# Altium project RMS.PrjPcb
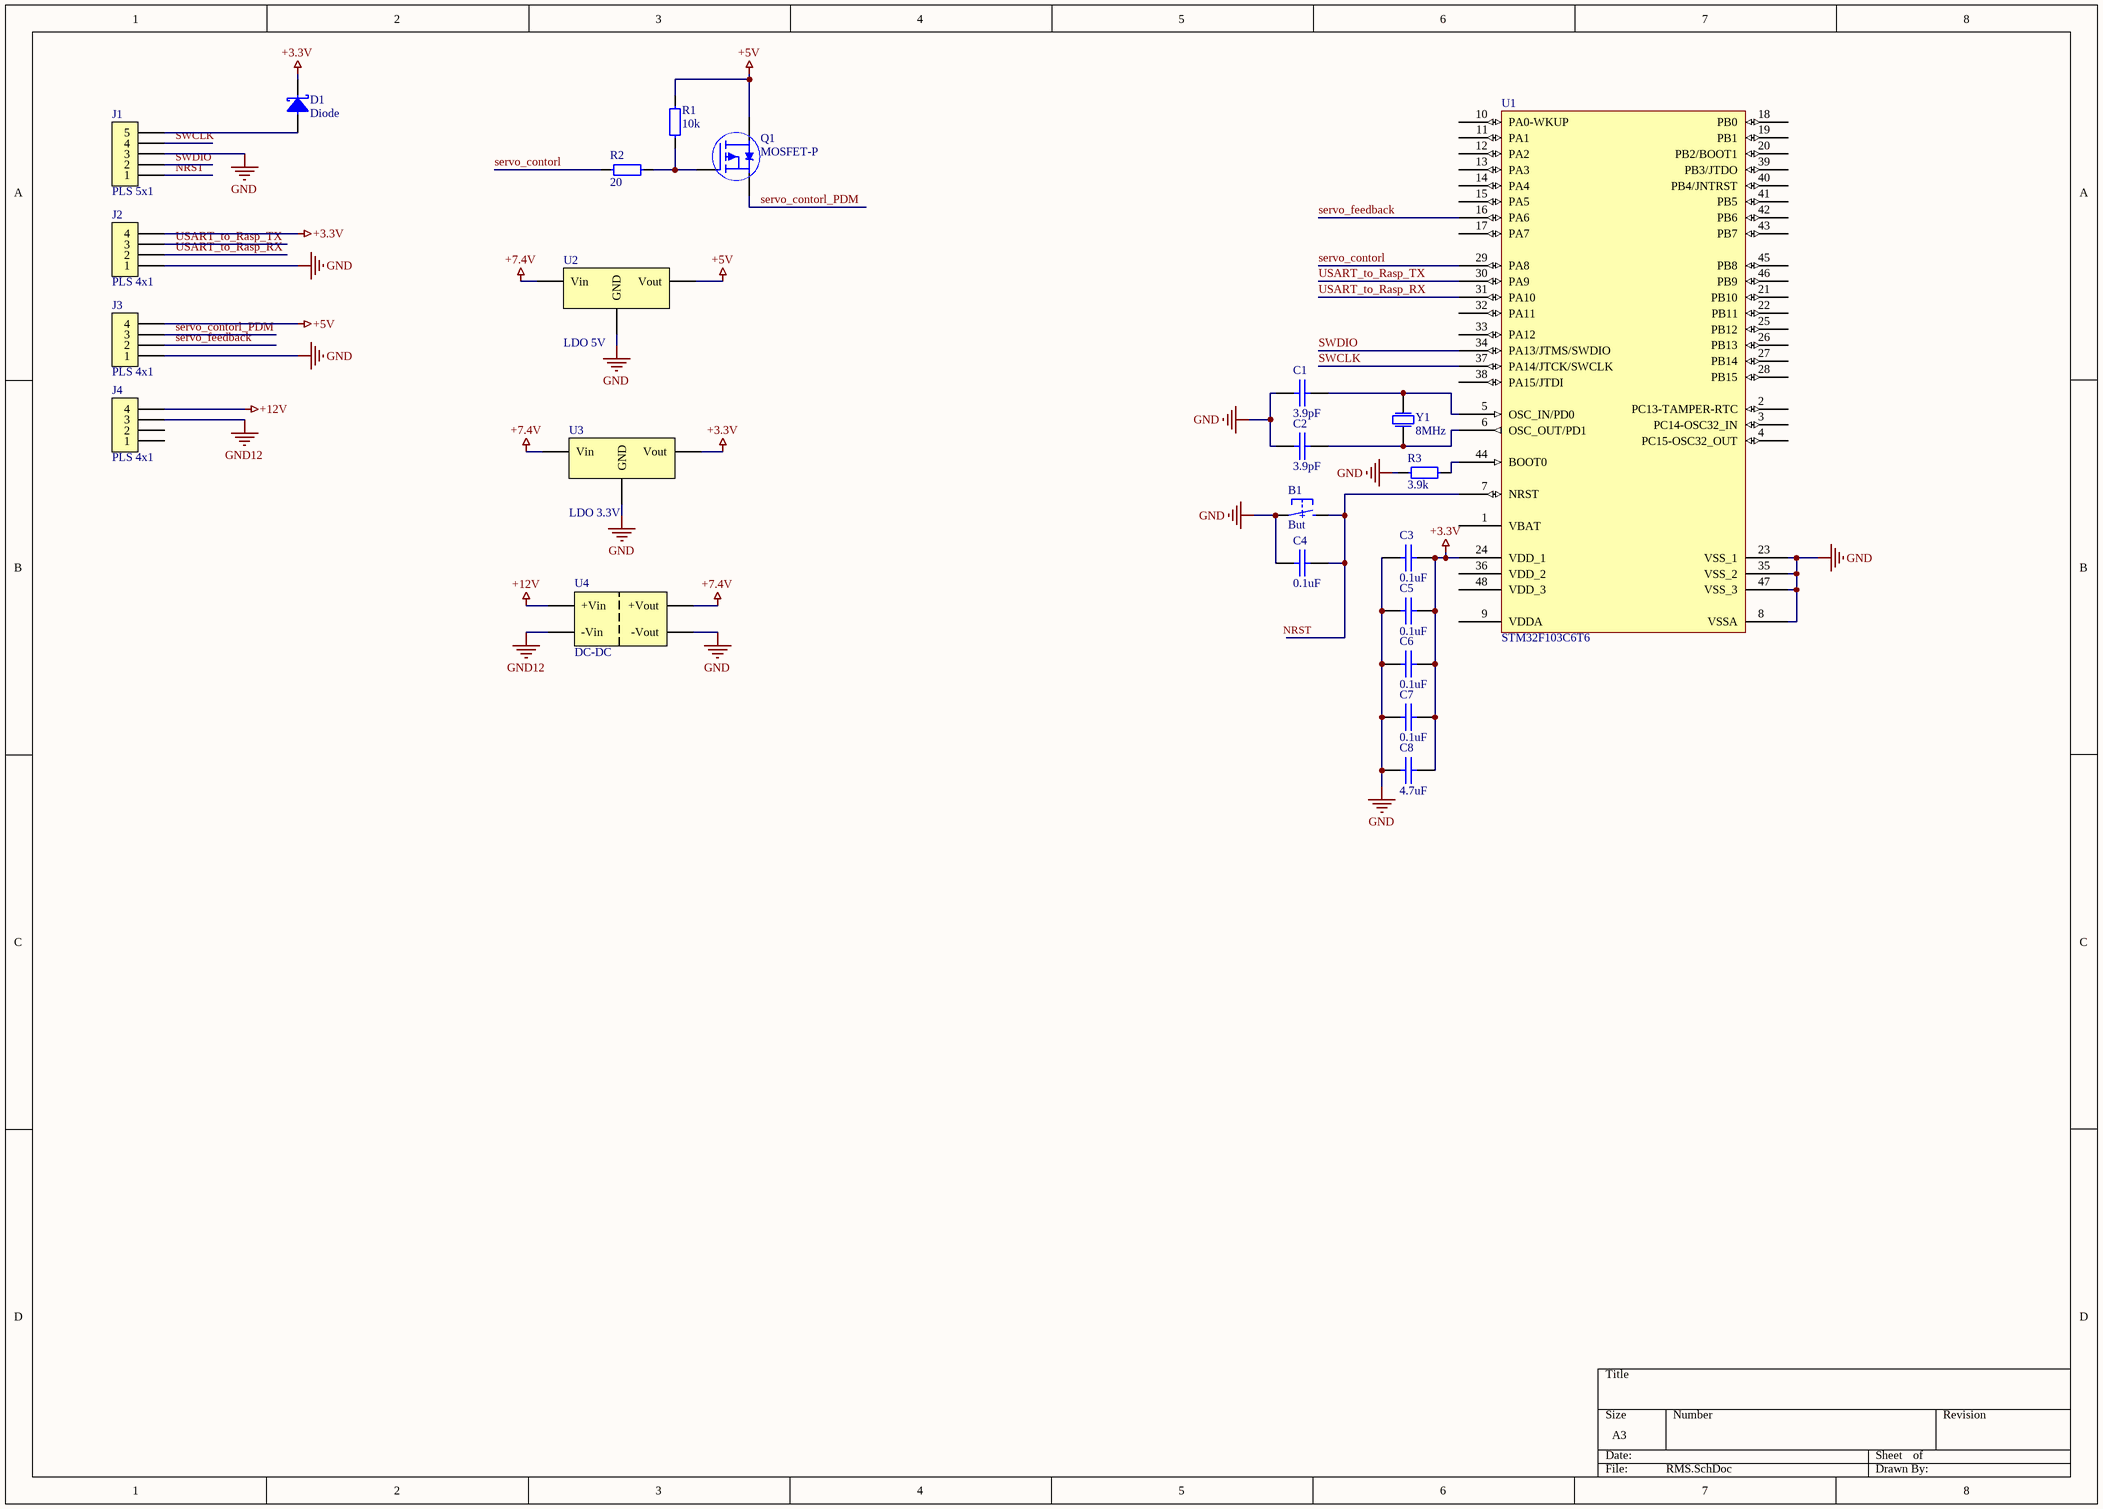
[diagram p0: RMS.SchDoc]
1 sheet, 23 parts. Net scope: global (net labels, ports and power ports of the same name join across sheets).
Board file: RMS.PcbDoc

## Sheet RMS.SchDoc
size A3; SheetNumber: 1; SheetTotal: 1

### Parts
B1  But  [BUTTON 6x3.5]
C1  3.9pF  [0805 Capicator]
C2  3.9pF  [0805 Capicator]
C3  0.1uF  [0805 Capicator]
C4  0.1uF  [0805 Capicator]
C5  0.1uF  [0805 Capicator]
C6  0.1uF  [0805 Capicator]
C7  0.1uF  [0805 Capicator]
C8  4.7uF  [0805 Capicator]
D1  Diode  [sod-123]
J1  PLS 5x1  [PLS 5x1]
J2  PLS 4x1  [PLS 4x1]
J3  PLS 4x1  [PLS 4x1]
J4  PLS 4x1  [PLS 4x1]
Q1  MOSFET-P  [SOT-23]
R1  10k  [0805 Resistor]
R2  20  [0805 Resistor]
R3  3.9k  [0805 Resistor]
U1  STM32F103C6T6  [STM32F103C6T6]
U2  LDO 5V  [TO-252]
U3  LDO 3.3V  [SOT-223]
U4  DC-DC  [DC-DC]
Y1  8MHz  [hc-49sm]

### Nets
+3.3V: C3.2 C5.2 C6.2 C7.2 C8.2 D1.2 J2.4 U1.24(VDD_1) U3.2(Vout)
+5V: J3.4 Q1.3(Drain) R1.2 U2.2(Vout)
+7.4V: U2.3(Vin) U3.3(Vin) U4.3(+Vout)
+12V: J4.4 U4.1(+Vin)
GND: B1.1 C1.1 C2.1 C3.1 C4.1 C5.1 C6.1 C7.1 C8.1 J1.3 J2.1 J3.1 R3.1 U1.8(VSSA) U1.23(VSS_1) U1.35(VSS_2) U1.47(VSS_3) U2.1(GND) U3.1(GND) U4.4(-Vout)
GND12: J4.3 U4.2(-Vin)
NRST: B1.2 C4.2 J1.1 U1.7(NRST)
servo_contorl: R2.1 U1.29(PA8)
servo_contorl_PDM: J3.3 Q1.2(Source)
servo_feedback: J3.2 U1.16(PA6)
SWCLK: J1.4 U1.37(PA14/JTCK/SWCLK)
SWDIO: J1.2 U1.34(PA13/JTMS/SWDIO)
USART_to_Rasp_RX: J2.2 U1.31(PA10)
USART_to_Rasp_TX: J2.3 U1.30(PA9)
NetC1_2: C1.2 U1.5(OSC_IN/PD0) Y1.2
NetC2_2: C2.2 U1.6(OSC_OUT/PD1) Y1.1
NetD1_1: D1.1 J1.5
NetQ1_1: Q1.1(Gate) R1.1 R2.2
NetR3_2: R3.2 U1.44(BOOT0)

Not connected (* = marked no-connect by the designer): J4 1 2; U1 1(VBAT) 2(PC13-TAMPER-RTC) 3(PC14-OSC32_IN) 4(PC15-OSC32_OUT) 9(VDDA) 10(PA0-WKUP) 11(PA1) 12(PA2) 13(PA3) 14(PA4) 15(PA5) 17(PA7) 18(PB0) 19(PB1) 20(PB2/BOOT1) 21(PB10) 22(PB11) 25(PB12) 26(PB13) 27(PB14) 28(PB15) 32(PA11) 33(PA12) 36(VDD_2) 38(PA15/JTDI) 39(PB3/JTDO) 40(PB4/JNTRST) 41(PB5) 42(PB6) 43(PB7) 45(PB8) 46(PB9) 48(VDD_3)

### Library data of the parts
B1 = Button: Button 2 Conn SMD
C1 C2 = Cap 39pF
C3-C7 = Cap 0.1uF
C8 = Cap 4.7uF
D1 = Diode Schottky: 0.5 A, Low Forward Voltage less than 385 mV, 400 mW Power Dissipation Package
J1 = Conn 5: Header, 5-Pin
J2-J4 = Conn 4: Header, 4-Pin
Q1 = MOSFET-P: P-Channel Power MOSFET 12V to 20V, Infineon
R1 = Res 10k
R2 = Res 20
R3 = Res 3.9k
U2 = LDO 5V: LDO Regulator Pos 5V 1A
U3 = LDO 3.3V: LDO Regulator Pos 3.3V 1.3A 4-Pin(3+Tab) SOT-223 T/R
Y1 = Crystal 8MHz: Crystal. HC-49SM (US)